# Altium schematic sheet elmo-adapter.SchDoc: ELMO Adapter
size A4; ApprovedBy: Yves Chevallier; CheckedBy: Yves Chevallier; Author: Yves Chevallier; CompanyName: HEIG-VD; DrawnBy: Yves Chevallier; Engineer: Yves Chevallier; Organization: HEIG-VD; Address1: HEIG-VD; Address2: CH-1400 Yverdon-les-Bains; Address3: +41 79 317 11 75; Address4: +41 79 317 11 75; DocumentNumber: ABC.00.0000.000.0; Revision: v1.0; SheetNumber: 0; SheetTotal: 0; DrawnByDate: 2021-02-28; ExecutionWarrantDate: 2021-02-28; ExecutionWarrant: Yves Chevallier; Context: RBT; PageSetup: Record=PageOptions|CenterHorizontal=True|CenterVertical=False|PrintScale=0.97|XCorrection=1.00|YCorrection=1.00|PrintKind=0|BorderSize=5000000|LeftOffset=0|BottomOffset=0|Orientation=2|PaperLength=1000|PaperWidth=1000|Scale=100|PaperSource=262|PrintQuality=600|MediaType=1|DitherType=10|PaperKind=A4|PrintScaleMode=1; EngineerDate: 2021-02-28; CheckedByDate: 2021-02-28; ProjectName: PRJ
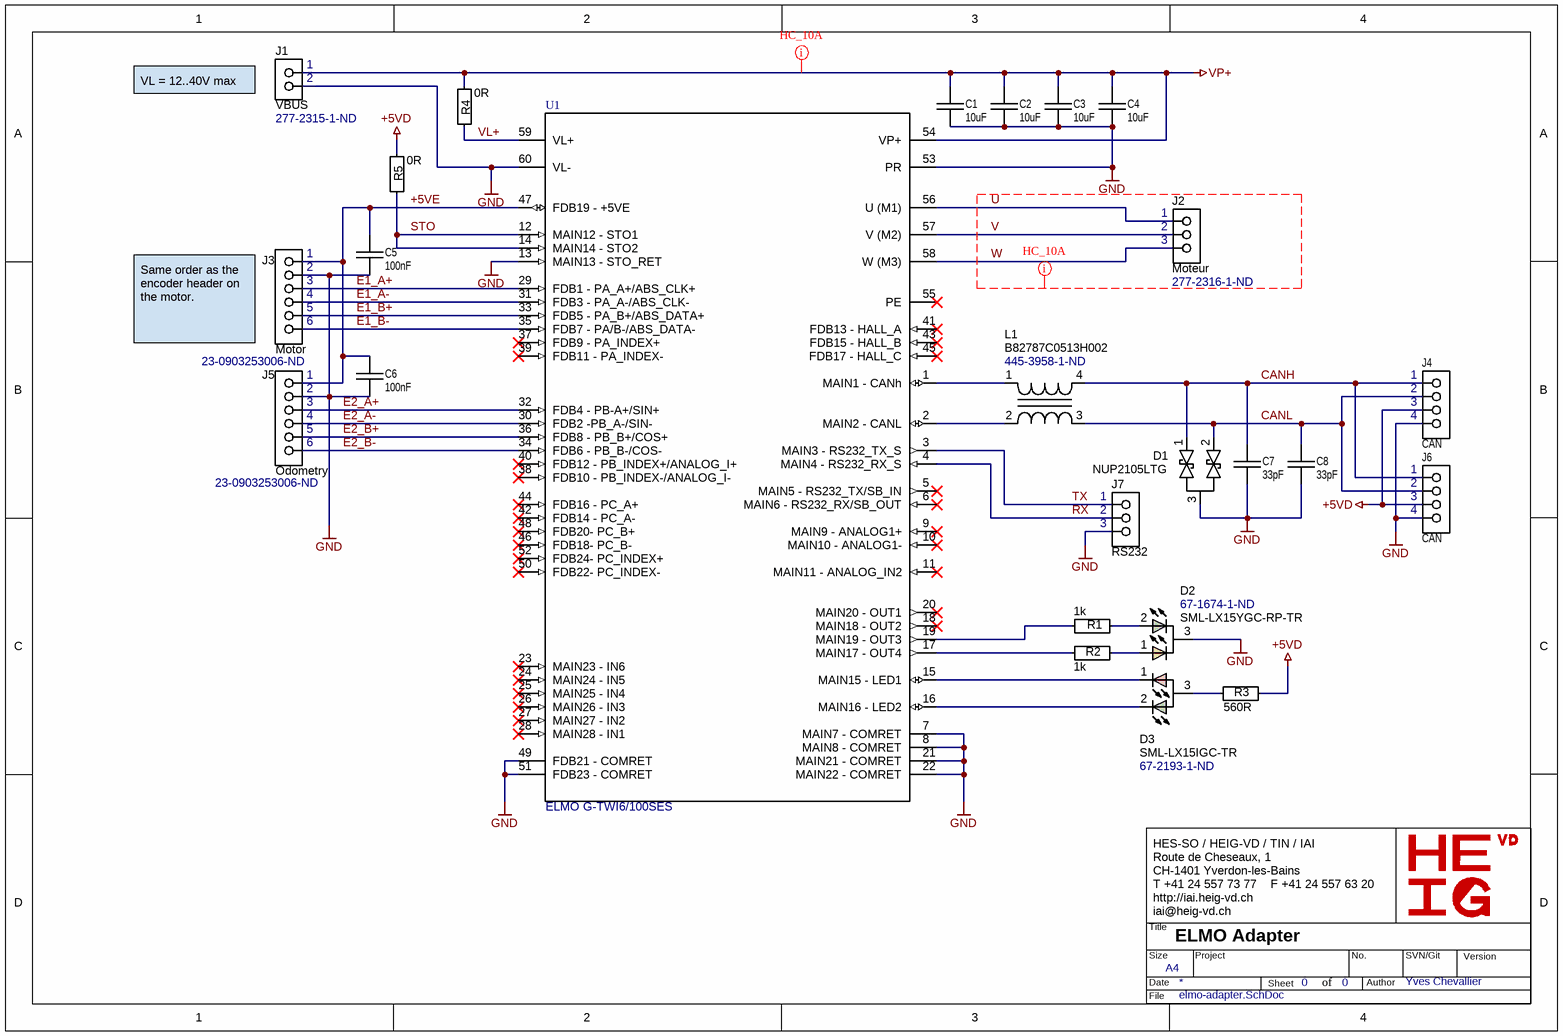
[diagram p0: elmo-adapter.SchDoc]

## Parts
C1  10uF  [SM/C0805]
C2  10uF  [SM/C0805]
C3  10uF  [SM/C0805]
C4  10uF  [SM/C0805]
C5  100nF  [SM/C0805]
C6  100nF  [SM/C0805]
C7  33pF  [SM/C0603]
C8  33pF  [SM/C0603]
D1  NUP2105LTG  [SOT23-3]
D2  SML-LX15YGC-RP-TR  Supplier Part Number 1: 67-1674-1-ND  [SOT23-3]
D3  SML-LX15IGC-TR  Supplier Part Number 1: 67-2193-1-ND  [SOT23-3]
J1  VBUS  Supplier Part Number 1: 277-2315-1-ND  [CONN 2POS 2.5mm 1778764]
J2  Moteur  Supplier Part Number 1: 277-2316-1-ND  [CONN 3POS 2.5mm 1778777]
J3  Motor  Supplier Part Number 1: 23-0903253006-ND  [CONN 6POS MOLEX 0903253006]
J4  CAN  [CONN4 MICROMATCH TE/215079-4]
J5  Odometry  Supplier Part Number 1: 23-0903253006-ND  [CONN 6POS MOLEX 0903253006]
J6  CAN  [CONN4 MICROMATCH TE/215079-4]
J7  RS232  [CONN/PIN3]
L1  B82787C0513H002  Supplier Part Number 1: 445-3958-1-ND  [ACT45B]
R1  1k  [SM/R0603]
R2  1k  [SM/R0603]
R3  560R  [SM/R0603]
R4  0R  [SM/R0805]
R5  0R  [SM/R0805]
U1  ELMO G-TWI6/100SES  [ELMO G-TWI]

## Nets
+5VD: J4.3 J6.3 R3.1 R5.1
GND: C1.2 C2.2 C3.2 C4.2 C5.2 C6.2 C7.2 C8.2 D1.3 D2.3(ANODE) J1.2 J3.2 J4.4 J5.2 J6.4 J7.3 U1.7(MAIN7_-_COMRET) U1.8(MAIN8_-_COMRET) U1.13(MAIN13_-_STO_RET) U1.21(MAIN21_-_COMRET) U1.22(MAIN22_-_COMRET) U1.49(FDB21_-_COMRET) U1.51(FDB23_-_COMRET) U1.53(PR) U1.60(VL-)
VP+: C1.1 C2.1 C3.1 C4.1 J1.1 R4.1 U1.54(VP+)
+5VE: C5.1 C6.1 J3.1 J5.1 U1.47(FDB19_-_+5VE)
CANH: C7.1 D1.1 J4.1 J6.1 L1.4
CANL: C8.1 D1.2 J4.2 J6.2 L1.3
E1_A+: J3.3 U1.29(FDB1_-_PA_A+/ABS_CLK+)
E1_A-: J3.4 U1.31(FDB3_-_PA_A-/ABS_CLK-)
E1_B+: J3.5 U1.33(FDB5_-_PA_B+/ABS_DATA+)
E1_B-: J3.6 U1.35(FDB7_-_PA/B-/ABS_DATA-)
E2_A+: J5.3 U1.32(FDB4_-_PB-A+/SIN+)
E2_A-: J5.4 U1.30(FDB2_-PB_A-/SIN-)
E2_B+: J5.5 U1.36(FDB8_-_PB_B+/COS+)
E2_B-: J5.6 U1.34(FDB6_-_PB_B-/COS-)
RX: J7.2 U1.4(MAIN4_-_RS232_RX_S)
STO: R5.2 U1.12(MAIN12_-_STO1) U1.14(MAIN14_-_STO2)
TX: J7.1 U1.3(MAIN3_-_RS232_TX_S)
U: J2.1 U1.56(U_(M1))
V: J2.2 U1.57(V_(M2))
VL+: R4.2 U1.59(VL+)
W: J2.3 U1.58(W_(M3))
NetD2_1: D2.1(K_RED) R2.1
NetD2_2: D2.2(K_GREEN) R1.1
NetD3_1: D3.1(K_RED) U1.15(MAIN15_-_LED1)
NetD3_2: D3.2(K_GREEN) U1.16(MAIN16_-_LED2)
NetD3_3: D3.3(ANODE) R3.2
NetL1_1: L1.1 U1.1(MAIN1_-_CANh)
NetL1_2: L1.2 U1.2(MAIN2_-_CANL)
NetR1_2: R1.2 U1.19(MAIN19_-_OUT3)
NetR2_2: R2.2 U1.17(MAIN17_-_OUT4)

Not connected (* = marked no-connect by the designer): U1 5(MAIN5_-_RS232_TX/SB_IN)* 6(MAIN6_-_RS232_RX/SB_OUT)* 9(MAIN9_-_ANALOG1+)* 10(MAIN10_-_ANALOG1-)* 11(MAIN11_-_ANALOG_IN2)* 18(MAIN18_-_OUT2)* 20(MAIN20_-_OUT1)* 23(MAIN23_-_IN6)* 24(MAIN24_-_IN5)* 25(MAIN25_-_IN4)* 26(MAIN26_-_IN3)* 27(MAIN27_-_IN2)* 28(MAIN28_-_IN1)* 37(FDB9_-_PA_INDEX+)* 38(FDB10_-_PB_INDEX-/ANALOG_I-)* 39(FDB11_-_PA_INDEX-)* 40(FDB12_-_PB_INDEX+/ANALOG_I+)* 41(FDB13_-_HALL_A)* 42(FDB14_-_PC_A-)* 43(FDB15_-_HALL_B)* 44(FDB16_-_PC_A+)* 45(FDB17_-_HALL_C)* 46(FDB18-_PC_B-)* 48(FDB20-_PC_B+)* 50(FDB22-_PC_INDEX-)* 52(FDB24-_PC_INDEX+)* 55(PE)*

## Layout directives
net class HC_10A: U, V, VP+, W

## Notes on the sheet
- (near J1) VL = 12..40V max
- Same order as the encoder header on the motor.
- HES-SO / HEIG-VD / TIN / IAI
  Route de Cheseaux, 1
  CH-1401 Yverdon-les-Bains
  T +41 24 557 73 77    F +41 24 557 63 20
  http://iai.heig-vd.ch
  iai@heig-vd.ch
- Title
- Size
- Date
- A4
- Project
- Sheet
- of
- No.
- Author
- SVN/Git
- Version
- File

## Library data of the parts
C1-C8 = C: Chip Capacitor
D2 = LED_SML-LX15YGC-RP-TR: LED GREEN/YELLOW CLEAR SOT23 SMD; Supplier 1: Digi-Key
D3 = LED_SML-LX15IGC-TR: LED GREEN/RED CLEAR SOT23 SMD; Supplier 1: Digi-Key
J1 = CONN 2: Supplier 1: Digi-Key
J2 J7 = CONN 3
  J2: Supplier 1: Digi-Key
J3 J5 = CONN 6: Supplier 1: Digi-Key
J4 J6 = CONN 4
L1 = L_B82787C0513H002: CMC 51UH 200MA 2LN SMD AEC-Q200; Supplier 1: Digi-Key
R1-R5 = R: Chip Resistor SMD
U1 = ELMO G-TWI6/100SES: Gold Twitter G-TWITTER 6A/100VDC CAN ENC VL95
D1 = NUP2105LTG: Supplier 1: Digi-Key; Supplier Part Number 1: NUP2105LT1GOSCT-ND